# Altium schematic sheet power-v5v5.SchDoc: Power 5.5V
size Letter; CheckedBy: J. Brinton; CompanyName: Signal Laboratories, Inc.; DrawnBy: J. Brinton; Engineer: J. Brinton; Address1: 3479 Edison Way; Address2: Menlo Park CA 94025; Address3: +1 (877) 778-8435; Address4: siglabs.com; Revision: 3; SheetNumber: 42; SheetTotal: 53
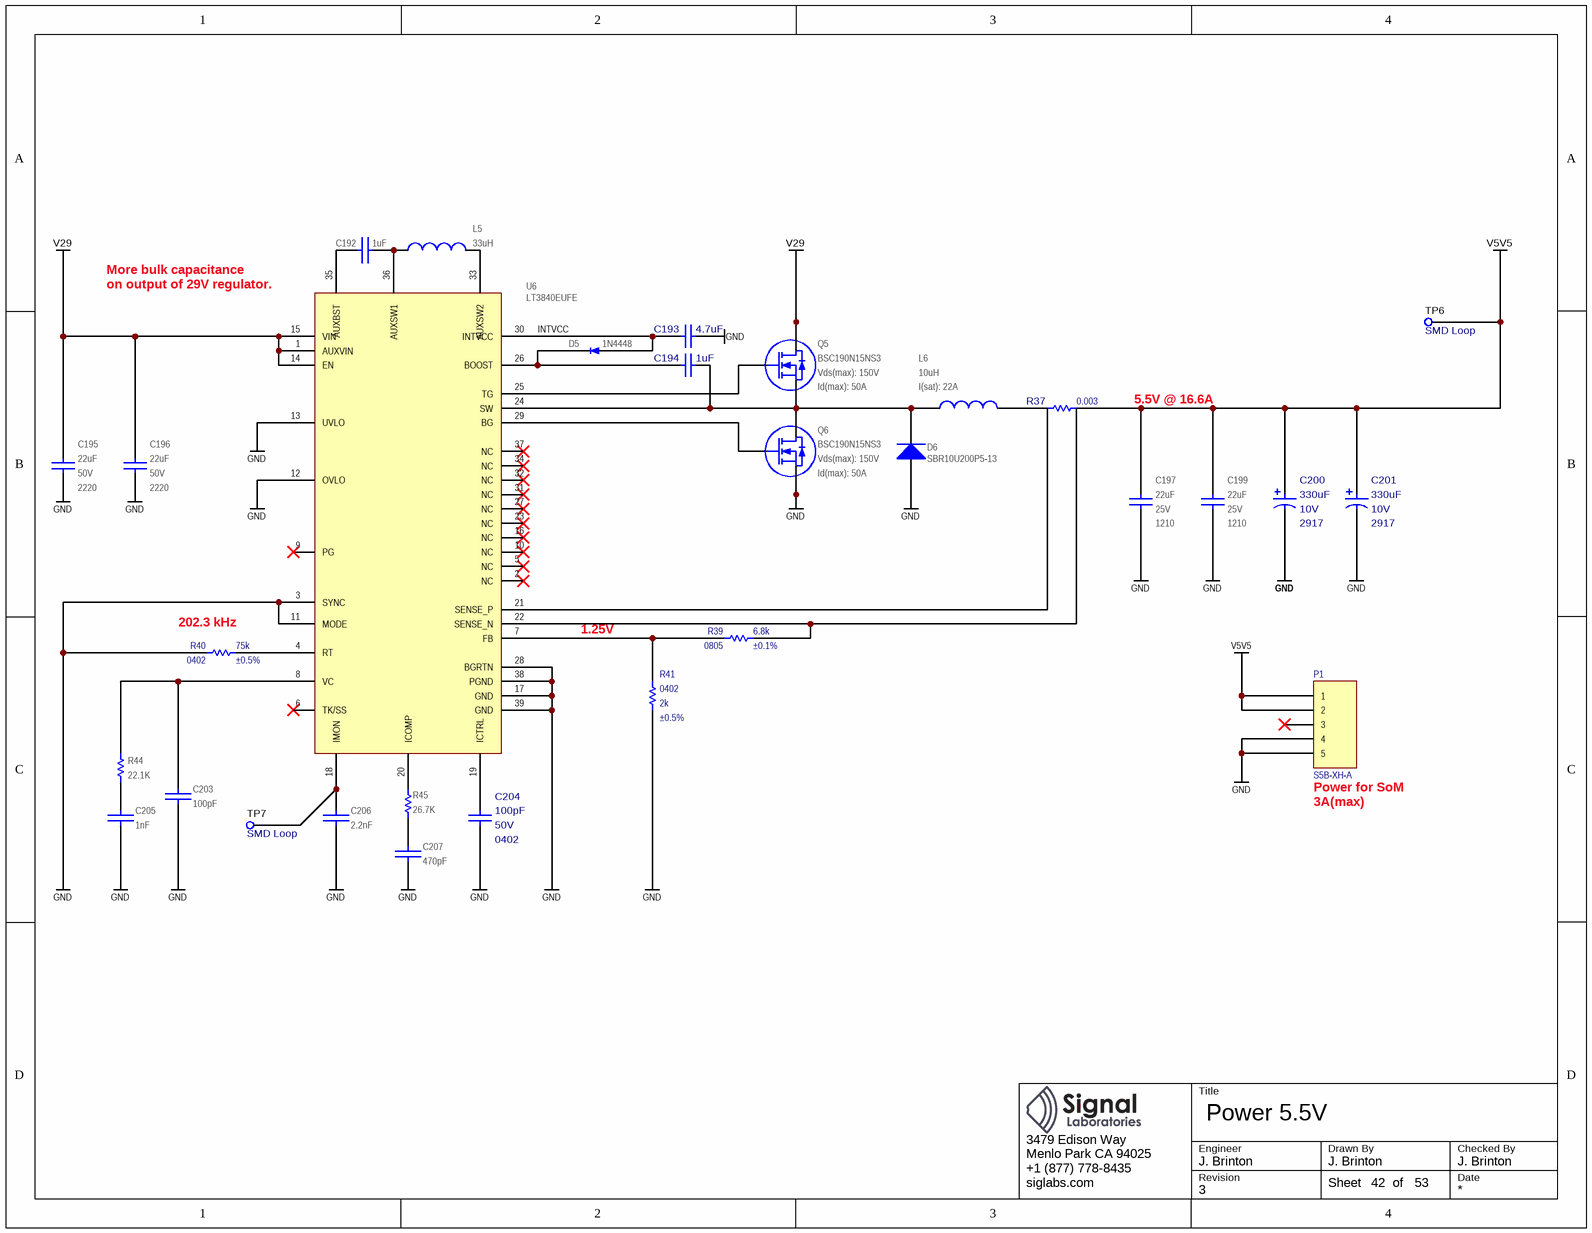
[diagram p0: power-v5v5.SchDoc]

## Parts
C192  value 1uF  [CAPC100X50X55L25N]  (hidden comment: GRM155R61A105KE15)
C193  value 4.7uF  [CAPC160X80X90L20N]  (hidden comment: CL10A475KA8NQNC)
C194  value 1uF  [CAPC100X50X55L25N]  (hidden comment: GRM155R61A105KE15)
C195  value 22uF  Voltage: 50V  Package: 2220  [CAPC600X500X500L160N]  (hidden comment: CKG57NX7S1H226M500JJ)
C196  value 22uF  Voltage: 50V  Package: 2220  [CAPC600X500X500L160N]  (hidden comment: CKG57NX7S1H226M500JJ)
C197  value 22uF  Voltage: 25V  Package: 1210  [CAPC320X250X270L50N]  (hidden comment: GRM32ER71E226KE15)
C199  value 22uF  Voltage: 25V  Package: 1210  [CAPC320X250X270L50N]  (hidden comment: GRM32ER71E226KE15)
C200  value 330uF  Package: 2917  Voltage: 10V  [CAPPM730X435X310L135X240N]  (hidden comment: TPSE337K010R0050)
C201  value 330uF  Package: 2917  Voltage: 10V  [CAPPM730X435X310L135X240N]  (hidden comment: TPSE337K010R0050)
C203  value 100pF  [CAPC100X50X55L25N]  (hidden comment: GRM1555C1H101JA01)
C204  value 100pF  Package: 0402  Voltage: 50V  [CAPC100X50X55L25N]  (hidden comment: VJ0402A101KXA)
C205  value 1nF  [CAPC100X50X55L25N]  (hidden comment: GRM1555C1H102JA01)
C206  value 2.2nF  [CAPC100X50X55L25N]  (hidden comment: C0402C222J3GACTU)
C207  value 470pF  [CAPC100X50X55L25N]  (hidden comment: GRM155R71H471JA01)
D5  Alternative P/N: 1N4448  [SOD323]  (hidden comment: 1N4448HWS-7-F)
D6  SBR10U200P5-13  [DIODES_POWERDI5]
L5  value 33uH  [ME3220]  (hidden comment: ME3220-333KL)
L6  value 10uH  I(sat): 22A  [HCM1A1707]  (hidden comment: PA4344.103ANLT)
P1  S5B-XH-A  [S5B-XH-A]
Q5  BSC190N15NS3  Vds(max): 150V  Id(max): 50A  [TDSON-8]
Q6  BSC190N15NS3  Vds(max): 150V  Id(max): 50A  [TDSON-8]
R37  value 0.003  [KRL3216T4]  (hidden comment: KRL3216T4A-M-R003-F)
R39  value 6.8k  Tolerance: ±0.1%  Package: 0805  [RESC2012X70N]  (hidden comment: RG2012P-682-B-T5)
R40  value 75k  Tolerance: ±0.5%  Package: 0402  [RESC1005X40N]  (hidden comment: RR0510P-753-D)
R41  value 2k  Tolerance: ±0.5%  Package: 0402  [RESC1005X40N]  (hidden comment: RR0510P-202-D)
R44  value 22.1K  [RESC1005X40N]  (hidden comment: ERJ-2RKF2212X)
R45  value 26.7K  [RESC1005X40N]  (hidden comment: ERJ-2RKF2672X)
TP6  Notes: SMD Loop  [5015]  (hidden comment: 5015)
TP7  Notes: SMD Loop  [5015]  (hidden comment: 5015)
U6  LT3840EUFE  [QFN39P40_600X400X80L40X20T465X265N]

## Nets
GND: C193.2 C195.1 C196.1 C197.1 C199.1 C200.2 C201.2 C203.1 C204.2 C205.2 C206.2 C207.1 D6.A P1.4 P1.5 Q6.1(S) Q6.2(S) Q6.3(S) R40.2 R41.1 U6.3(SYNC) U6.11(MODE) U6.12(OVLO) U6.13(UVLO) U6.17(GND) U6.28(BGRTN) U6.38(PGND) U6.39(GND)
V5V5: C197.2 C199.2 C200.1 C201.1 P1.1 P1.2 R37.1 TP6.1
V29: C195.2 C196.2 Q5.5(D) Q5.6(D) Q5.7(D) Q5.8(D) Q5.9(D) U6.1(AUXVIN) U6.14(EN) U6.15(VIN)
INTVCC: C193.1 D5.A U6.30(INTVCC)
NetC192_1: C192.1 L5.1 U6.36(AUXSW1)
NetC192_2: C192.2 U6.35(AUXBST)
NetC194_1: C194.1 D5.K U6.26(BOOST)
NetC194_2: C194.2 D6.K L6.1 Q5.1(S) Q5.2(S) Q5.3(S) Q6.5(D) Q6.6(D) Q6.7(D) Q6.8(D) Q6.9(D) U6.24(SW)
NetC203_2: C203.2 R44.2 U6.8(VC)
NetC204_1: C204.1 U6.19(ICTRL)
NetC205_1: C205.1 R44.1
NetC206_1: C206.1 TP7.1 U6.18(IMON)
NetC207_2: C207.2 R45.2
NetL5_2: L5.2 U6.33(AUXSW2)
NetL6_2: L6.2 R37.2
NetQ5_4: Q5.4(G) U6.25(TG)
NetQ6_4: Q6.4(G) U6.29(BG)
NetR37_3: R37.3 R39.1 U6.22(SENSE_N)
NetR37_4: R37.4 U6.21(SENSE_P)
NetR39_2: R39.2 R41.2 U6.7(FB)
NetR40_1: R40.1 U6.4(RT)
NetR45_1: R45.1 U6.20(ICOMP)

Not connected (* = marked no-connect by the designer): P1 3*; U6 2(NC)* 5(NC)* 6(TK/SS)* 9(PG)* 10(NC)* 16(NC)* 23(NC)* 27(NC)* 31(NC)* 32(NC)* 34(NC)* 37(NC)*

## Notes on the sheet
- More bulk capacitance
- (near U6) on output of 29V regulator.
- 5.5V @ 16.6A
- (near R40) 202.3 kHz
- 1.25V
- (near P1) Power for SoM
- (near P1) 3A(max)
- Title
- Engineer
- Revision
- Drawn By
- Checked By
- Date
- Sheet
- of

## Library data of the parts
C192 = CAP: Ceramic Capacitor 1uF ±10% 10V X5R 0402; Manufacturer: Murata; Tr: -55:125; Manufacturer P/N: GRM155R61A105KE15; Package: 0402; Tolerance: ±10%; Voltage: 10V
C193 = TMK212B7475KG: Ceramic Capacitor 4.7uF ±10% 25V X5R 0603; Manufacturer: Samsung; Tr: -55:85; Manufacturer P/N: CL10A475KA8NQNC; Tolerance: ±10%; Package: 0603; Voltage: 25V
C194 = UMK212B7105KG: Ceramic Capacitor 1uF ±10% 10V X5R 0402; Manufacturer: Murata; Voltage: 50V; Manufacturer P/N: GRM155R61A105KE15; Tolerance: ±10%; Tr: *; Package: 0402
C195 C196 = CAP: Ceramic Capacitor 22uF ±20% 50V X7S Stacked; Manufacturer: TDK; Tr: -55:125; Manufacturer P/N: CKG57NX7S1H226M500JJ; Tolerance: ±20%
C197 C199 = CAP: Ceramic Capacitor 22uF ±10% 25V X7R 1210; Manufacturer: Murata; Tr: -55:125; Manufacturer P/N: GRM32ER71E226KE15; Tolerance: ±10%
C200 C201 = CAP_POL: Tantalum Capacitor 330uF ±10% 10V 2917; Manufacturer: AVX; Tr: -55:125; Manufacturer P/N: TPSE337K010R0050; Tolerance: ±10%
C203 = CAP: Ceramic Capacitor 100pF ±5% 50V NP0 0402; Manufacturer: Murata; Tr: -55:125; Manufacturer P/N: GRM1555C1H101JA01; Voltage: 50V; Package: 0402; Tolerance: ±5%
C204 = VJ0402A101KXA: Ceramic Capacitor 100pF ±10% 50V C0G 0402; Manufacturer: Vishay; Tr: -55:150; Manufacturer P/N: VJ0402A101KXA; Tolerance: ±10%
C205 = CAP: Ceramic Capacitor 1nF ±5% 50V NP0 0402; Manufacturer: Murata; Tr: -55:125; Manufacturer P/N: GRM1555C1H102JA01; Voltage: 50V; Package: 0402; Tolerance: ±5%
C206 = CAP: Ceramic Capacitor 2.2nF ±5% 25V NP0 0402; Manufacturer: Kemet; Tr: -55:125; Manufacturer P/N: C0402C222J3GACTU; Package: 0402; Tolerance: ±5%; Voltage: 25V
C207 = CAP: Ceramic Capacitor 470pF ±5% 50V X7R 0402; Manufacturer: Murata; Tr: -55:125; Manufacturer P/N: GRM155R71H471JA01; Voltage: 50V; Package: 0402; Tolerance: ±5%
D5 = 1N4448HWS-7-F: Schottky Diode 80V 250mA SOD323; Manufacturer: Diodes Inc; Manufacturer P/N: 1N4448HWS-7-F; Package: SOD323
D6 = PDS5100H: Schottky Diode 200V 10A SMD; Manufacturer: Diodes Inc; Manufacturer P/N: SBR10U200P5-13; Current: 10A; Reverse Voltage (max): 200V; Package: PowerDi-5
L5 = COIL: Inductor 33uH ±10% 500mA SMD; Manufacturer: Coilcraft; Tr: -40:85; Manufacturer P/N: ME3220-333KL; I(sat): 500mA; Package: *; Tolerance: ±10%
L6 = COIL: Inductor 10uH, 22A(sat), SMD; Manufacturer: Pulse Electronics Power; Notes: Same size inductor as HCM1A1707; Manufacturer P/N: PA4344.103ANLT
P1 = S5B-XH-A: 2.5mm pitch right angle 5-position; Manufacturer: JST; Manufacturer P/N: S5B-XH-A
Q5 Q6 = BSC190N15NS3: MOSFET N-Channel Enhancement Mode; Manufacturer: Infineon; Rds(on): 19mOhm; Manufacturer P/N: BSC190N15NS3
R37 = KRL3216T4A-M-R009-F: Current Sense Resistor 3 mOhms +/-1% SMD 4-Terminal; Manufacturer: Susumu; Tolerance: ±1%; Tr: -55:+155; Manufacturer P/N: KRL3216T4A-M-R003-F
R39 = RES: Thin Film Resistor 6.8k +/-0.1% SMD 0805; Manufacturer: Susumu; Tr: -55:155; Tcr: *; Manufacturer P/N: RG2012P-682-B-T5; Alternatives: *; Voltage: *; Power: *
R40 = RES: Thin Film Resistor 75k +/-0.5% SMD 0402; Manufacturer: Susumu; Tr: -55:155; Tcr: *; Manufacturer P/N: RR0510P-753-D; Alternatives: *; Voltage: *; Power: *
R41 = RES: Thin Film Resistor 2k +/-0.5% SMD 0402; Manufacturer: Susumu; Tr: -55:155; Tcr: *; Manufacturer P/N: RR0510P-202-D; Alternatives: *; Voltage: *; Power: *
R44 = RES 0402: Thick Film Resistor 22.1k ±1% 0402; Manufacturer: Panasonic; Tr: -55:155; Package: 0402; Manufacturer P/N: ERJ-2RKF2212X; Tolerance: ±1%
R45 = RES 0402: Thick Film Resistor 26.7k ±1% 0402; Manufacturer: Panasonic; Tr: -55:155; Package: 0402; Manufacturer P/N: ERJ-2RKF2672X; Tolerance: ±1%
TP6 TP7 = TEST_POINT_SMD_50: Test Point SMD; Manufacturer: Keystone; Manufacturer P/N: 5015
U6 = LT3840EUFE: Synchronous Regulator Controller; Manufacturer: Linear Technology; Alternative P/N: LT3840IUFE; Manufacturer P/N: LT3840EUFE